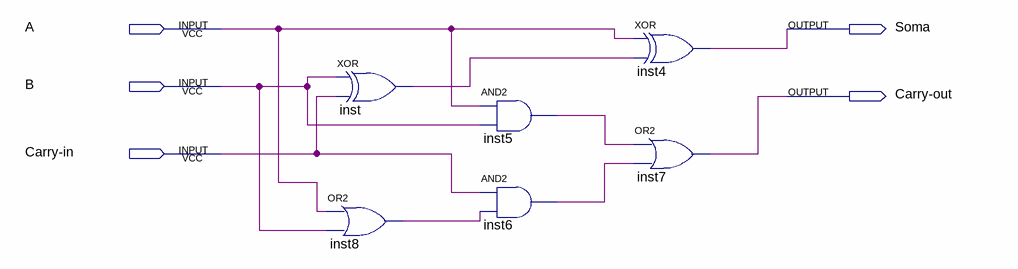
[diagram p0: schematic sheet]
// Quartus schematic SOMA1-DIAGRAMA.bdf as structural Verilog: 6 symbols, 5 pins
module \SOMA1-DIAGRAMA  (
  input  A,
  input  B,
  input  \Carry-in ,
  output Soma,
  output \Carry-out 
);

  wire inst5_out, inst6_out, inst8_out, inst_out;

  xor inst (inst_out, B, \Carry-in );
  or inst8 (inst8_out, A, B);
  and inst5 (inst5_out, A, B);
  and inst6 (inst6_out, \Carry-in , inst8_out);
  xor inst4 (Soma, A, inst_out);
  or inst7 (\Carry-out , inst5_out, inst6_out);
endmodule
